# Altium schematic sheet MKRWANV1.0_1.SchDoc: MKRWANV1.0
size 409 x 289 mm; Origin: Eagle; Date: 4/10/2019 9:46:02 AM; SheetNumber: 2; CODE-ARDUINO: DNP; DATASHEET: DNP; DISTRIBUTOR-LINK: DNP; DISTRIBUTOR-PN: DNP; MANUFACTURER: DNP; MANUFACTURER-PN: DNP; NOTE: DNP; Value: DNP; GateName_1: G$1; SymbolName_1: A3L-LOC; LibraryName: Arduino-utility; DeviceSetName: A3-FRAME; Sheet: Sheet:; ReferenceDesignsAREPROVIDED"ASIS"AND"WITHALLFAULTS.ArduinoSADISCLAIMSALLOTHERWARRANTIES,EXPRESSORIMPLIED,
REGARDINGPRODUCTS,INCLUDINGBUTNOTLIMITEDTO,ANYIMPLIEDWARRANTIESOFMERCHANTABILITYORFITNESSFORAPARTICULARPURPOSE

ArduinoSAmaymakechangestospecificationsandproductdescriptionsatanytime,withoutnotice.TheCustomermustnot
relyontheabsenceorcharacteristicsofanyfeaturesorinstructionsmarked"reserved"or"undefined."ArduinoSAreserves
theseforfuturedefinitionandshallhavenoresponsibilitywhatsoeverforconflictsorincompatibilitiesarisingfromfuturechangestothem.
TheproductinformationontheWebSiteorMaterialsissubjecttochangewithoutnotice.Donotfinalizeadesignwiththisinfo

ARDUINOandotherArduinobrandsandlogosandTrademarksofArduinoSA.AllArduinoSATrademarkscannotbeusedwithoutowner'sformalpermission: Reference Designs ARE PROVIDED "AS IS" AND "WITH ALL FAULTS. Arduino SA DISCLAIMS ALL OTHER WARRANTIES, EXPRESS OR IMPLIED, / REGARDING PRODUCTS, INCLUDING BUT NOT LIMITED TO, ANY IMPLIED WARRANTIES OF MERCHANTABILITY OR FITNESS FOR A PARTICULAR PURPOSE / Arduino SA may make changes to specifications and product descriptions at any time, without notice. The Customer must not / rely on the absence or characteristics of any features or instructions marked "reserved" or "undefined." Arduino SA reserves / these for future definition and shall have no responsibility whatsoever for conflicts or incompatibilities arising from future changes to them. / The product information on the Web Site or Materials is subject to change without notice. Do not finalize a design with this info / ARDUINO and other Arduino brands and logos and Trademarks of Arduino SA. All Arduino SA Trademarks cannot be used without owner's formal permission
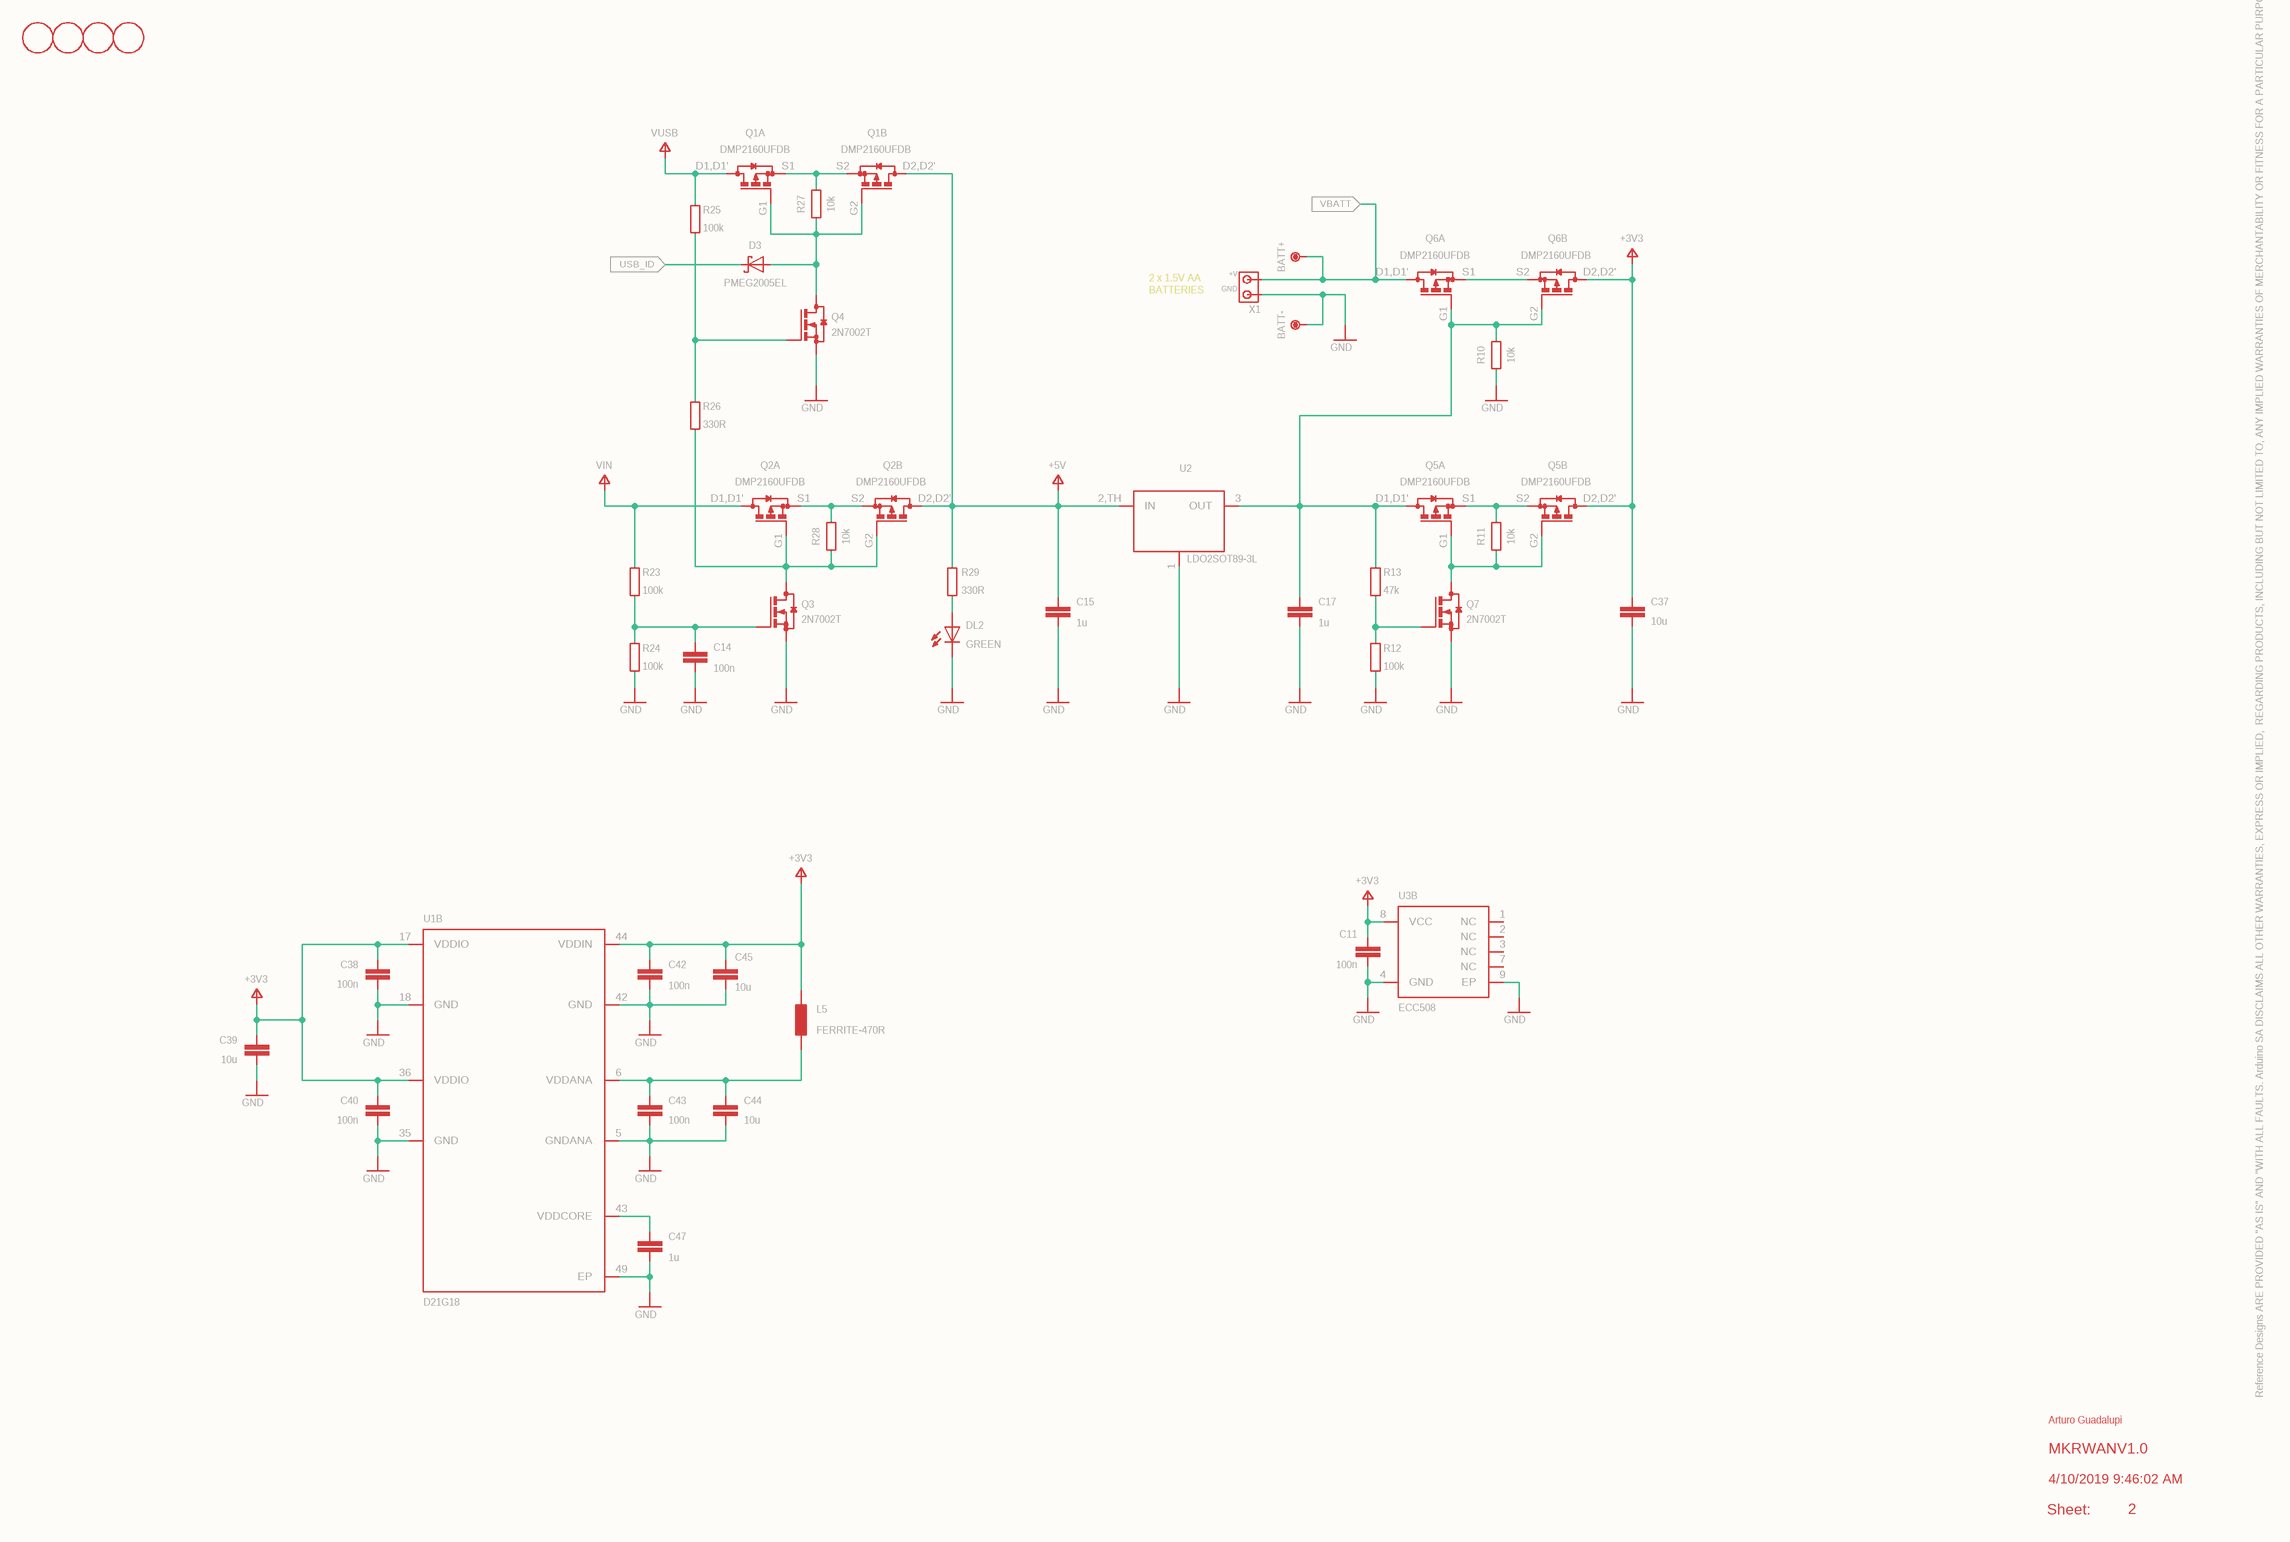
[diagram p0: MKRWANV1.0_1.SchDoc]

## Parts
+3V1  +3V3
+3V38  +3V3
+3V310  +3V3
+3V313  +3V3
BATT+  DNP  [TP-1.00MM]  (value not drawn)
BATT-  DNP  [TP-1.00MM]  (value not drawn)
C11  100n  [0402-1005X55N]
C14  100n  [0402-1005X55N]
C15  1u  [0402-1005X55N]
C17  1u  [0402-1005X55N]
C37  10u  [0603-1608X90N]
C38  100n  [0402-1005X55N]
C39  10u  [0603-1608X90N]
C40  100n  [0402-1005X55N]
C42  100n  [0402-1005X55N]
C43  100n  [0402-1005X55N]
C44  10u  [0603-1608X90N]
C45  10u  [0603-1608X90N]
C47  1u  [0402-1005X55N]
D3  PMEG2005EL  [SODFL1008X40N-882D]
DL2  GREEN  [LEDC1608X80N-AK]
FD1  DNP  [FD-1-1.5]  (value not drawn)
FD2  DNP  [FD-1-1.5]  (value not drawn)
FD3  DNP  [FD-1-1.5]  (value not drawn)
FD4  DNP  [FD-1-1.5]  (value not drawn)
GND14  GND
GND16  GND
GND18  GND
GND20  GND
GND25  GND
GND26  GND
GND27  GND
GND28  GND
GND29  GND
GND30  GND
GND31  GND
GND32  GND
GND40  GND
GND45  GND
GND46  GND
GND47  GND
GND48  GND
GND49  GND
GND51  GND
GND52  GND
GND53  GND
L5  FERRITE-470R  [0603-1608X90N@1]
P+3  +5V
Q1  DMP2160UFDB  [PWR_SC70]  (parts A,B of 2)
Q2  DMP2160UFDB  [PWR_SC70]  (parts A,B of 2)
Q3  2N7002T  [SOTFL50P160X78-3]
Q4  2N7002T  [SOTFL50P160X78-3]
Q5  DMP2160UFDB  [PWR_SC70]  (parts A,B of 2)
Q6  DMP2160UFDB  [PWR_SC70]  (parts A,B of 2)
Q7  2N7002T  [SOTFL50P160X78-3]
R10  10k  [0402-1005X55N]
R11  10k  [0402-1005X55N]
R12  100k  [0402-1005X55N]
R13  47k  [0402-1005X55N]
R23  100k  [0402-1005X55N]
R24  100k  [0402-1005X55N]
R25  100k  [0402-1005X55N]
R26  330R  [0402-1005X55N]
R27  10k  [0402-1005X55N]
R28  10k  [0402-1005X55N]
R29  330R  [0402-1005X55N]
U1  D21G18  [QFN50P700X700X90-49XN-EPSQ515]  (part B of 2)
U2  LDO2SOT89-3L  [SOT89-3L]
U3  ECC508  [SON50P300X200X60-9N-EP160X140]  (part B of 2)
V2  VUSB
VIN2  VIN
X1  SCREW2X2.54  [SCREW2]  (value not drawn)

## Ports
USB_ID (in), VBATT (in)

## Nets
USB_ID: D3.C ; port USB_ID
VBATT: BATT+.X(P$1) Q6.D1,D1'(D) X1.V+ ; port VBATT
Net+3V1_?1: +3V1.?1(+3V3) C11.1 U3.8(VCC)
Net+3V38_?1: +3V38.?1(+3V3) C37.1 Q5.D2,D2'(D) Q6.D2,D2'(D)
Net+3V310_?1: +3V310.?1(+3V3) C38.1 C39.1 C40.1 U1.17(VDDIO) U1.36(VDDIO)
Net+3V313_?1: +3V313.?1(+3V3) C42.1 C45.1 L5.1 U1.44(VDDIN)
NetBATT-_X: BATT-.X(P$1) GND32.?1(GND) X1.GND
NetC11_2: C11.2 GND25.?1(GND) U3.4(GND)
NetC14_1: C14.1 Q3.G R23.1 R24.2
NetC14_2: C14.2 GND29.?1(GND)
NetC15_1: C15.1 P+3.?1(+5V) Q1.D2,D2'(D) Q2.D2,D2'(D) R29.2 U2.2,TH(IN)
NetC15_2: C15.2 GND31.?1(GND)
NetC17_1: C17.1 Q5.D1,D1'(D) Q6.G1(G) Q6.G2(G) R10.2 R13.2 U2.3(OUT)
NetC17_2: C17.2 GND45.?1(GND)
NetC37_2: C37.2 GND46.?1(GND)
NetC38_2: C38.2 GND47.?1(GND) U1.18(GND)
NetC39_2: C39.2 GND48.?1(GND)
NetC40_2: C40.2 GND49.?1(GND) U1.35(GND)
NetC42_2: C42.2 C45.2 GND51.?1(GND) U1.42(GND)
NetC43_1: C43.1 C44.1 L5.2 U1.6(VDDANA)
NetC43_2: C43.2 C44.2 GND52.?1(GND) U1.5(GNDANA)
NetC47_1: C47.1 U1.43(VDDCORE)
NetC47_2: C47.2 GND53.?1(GND) U1.49(EP)
NetD3_A: D3.A Q1.G1(G) Q1.G2(G) Q4.D R27.1
NetDL2_A: DL2.A R29.1
NetDL2_C: DL2.C GND30.?1(GND)
NetGND14_?1: GND14.?1(GND) R10.1
NetGND16_?1: GND16.?1(GND) R12.1
NetGND18_?1: GND18.?1(GND) Q7.S
NetGND20_?1: GND20.?1(GND) U2.1(GND/ADJ)
NetGND26_?1: GND26.?1(GND) R24.1
NetGND27_?1: GND27.?1(GND) Q3.S
NetGND28_?1: GND28.?1(GND) Q4.S
NetGND40_?1: GND40.?1(GND) U3.9(EP)
NetQ1_D1,D1': Q1.D1,D1'(D) R25.2 V2.?1(VUSB)
NetQ1_S1: Q1.S1(S) Q1.S2(S) R27.2
NetQ2_D1,D1': Q2.D1,D1'(D) R23.2 VIN2.?1(VIN)
NetQ2_G1: Q2.G1(G) Q2.G2(G) Q3.D R26.1 R28.1
NetQ2_S1: Q2.S1(S) Q2.S2(S) R28.2
NetQ4_G: Q4.G R25.1 R26.2
NetQ5_G1: Q5.G1(G) Q5.G2(G) Q7.D R11.1
NetQ5_S1: Q5.S1(S) Q5.S2(S) R11.2
NetQ6_S1: Q6.S1(S) Q6.S2(S)
NetQ7_G: Q7.G R12.2 R13.1

Not connected (* = marked no-connect by the designer): U3 1(NC) 2(NC) 3(NC) 7(NC)

## Notes on the sheet
- (near X1) 2 x 1.5V AA
  BATTERIES
- Reference Designs ARE PROVIDED "AS IS" AND "WITH ALL FAULTS. Arduino SA DISCLAIMS ALL OTHER WARRANTIES, EXPRESS OR IMPLIED,
  REGARDING PRODUCTS, INCLUDING BUT NOT LIMITED TO, ANY IMPLIED WARRANTIES OF MERCHANTABILITY OR FITNESS FOR A PARTICULAR PURPOSE
  Arduino SA may make changes to specifications and product descriptions at any time, without notice. The Customer must not
  rely on the absence or characteristics of any features or instructions marked "reserved" or "undefined." Arduino SA reserves
  these for future definition and shall have no responsibility whatsoever for conflicts or incompatibilities arising from future changes to them.
  The product information on the Web Site or Materials is subject to change without notice. Do not finalize a design with this info
  ARDUINO and other Arduino brands and logos and Trademarks of Arduino SA. All Arduino SA Trademarks cannot be used without owner's formal permission
- Arturo Guadalupi
- MKRWANV1.0
- Sheet:
- 4/10/2019 9:46:02 AM
- 2

## Library data of the parts
+3V1 +3V38 +3V310 +3V313 = +3V3: SUPPLY SYMBOL; GateName_1: G$1; SymbolName_1: +3V3; LibraryName: MK1_Zero; DeviceSetName: +3V3
BATT+ BATT- = TPTP-1.00MM: Testpoint; GateName_1: G$1; DeviceSetName: TP; SymbolName_1: TESTPOINT; DeviceName: TP-1.00MM; LibraryName: Arduino-utility; DATASHEET: DNP; DISTRIBUTOR-LINK: DNP; DISTRIBUTOR-PN: DNP; MANUFACTURER: DNP; MANUFACTURER-PN: DNP
C11 C14 C38 C40 C42 C43 = C-0402: SMD Capacitor; MANUFACTURER: TDK; MANUFACTURER-PN: C1005X5R1H104K050BB; GateName_1: G$1; SymbolName_1: C; DeviceName: -0402; LibraryName: Arduino-rcl; DeviceSetName: C; DATASHEET: http://www.tdk.com/pdf/TDKMLCCCapRange.pdf; DISTRIBUTOR-LINK: http://www.digikey.com/product-detail/en/tdk-corporation/C1005X5R1H104K050BB/445-5942-1-ND/2443982; DISTRIBUTOR-PN: 445-5942-1-ND
C15 C17 C47 = C-0402: SMD Capacitor; MANUFACTURER: Murata; MANUFACTURER-PN: GRM155R61E105KA12D; GateName_1: G$1; SymbolName_1: C; DeviceName: -0402; LibraryName: Arduino-rcl; DeviceSetName: C; DATASHEET: http://search.murata.co.jp/Ceramy/image/img/A01X/partnumbering_e_01.pdf; DISTRIBUTOR-LINK: http://www.digikey.com/product-detail/en/murata-electronics-north-america/GRM155R61E105KA12D/490-10017-1-ND/5026367; DISTRIBUTOR-PN: 490-10017-1-ND
C37 C39 C44 C45 = C-0603: SMD Capacitor; MANUFACTURER: Murata; MANUFACTURER-PN: GRM188R61C106KAALD; GateName_1: G$1; SymbolName_1: C; DeviceName: -0603; LibraryName: Arduino-rcl; DeviceSetName: C; DATASHEET: http://www.murata.com/~/media/webrenewal/support/library/catalog/products/capacitor/mlcc/c02e.pdf; DISTRIBUTOR-LINK: http://www.digikey.com/product-search/en?keywords=490-10728-1-ND; DISTRIBUTOR-PN: 490-10728-1-ND
D3 = PMEG2005EL: DIODE SCHOTTKY 20V 500MA SOD882; MANUFACTURER: NXP; MANUFACTURER-PN: PMEG2005EL,315; GateName_1: G$1; SymbolName_1: SCHOTTKY-1; LibraryName: Arduino-diodes; DeviceSetName: PMEG2005EL; DATASHEET: http://www.nxp.com/documents/data_sheet/PMEG2005EL.pdf; DISTRIBUTOR-LINK: http://www.digikey.com/product-detail/en/nxp-semiconductors/PMEG2005EL,315/568-6754-1-ND/2676794; DISTRIBUTOR-PN: 568-6754-1-ND
DL2 = LED-0603: LED; MANUFACTURER: Avago; MANUFACTURER-PN: HSMG-C190; GateName_1: G$1; DeviceName: -0603; SymbolName_1: LED; LibraryName: Arduino-diodes; DeviceSetName: LED; DATASHEET: http://media.digikey.com/pdf/Data%20Sheets/Avago%20PDFs/HSMz-Czzz.pdf; DISTRIBUTOR-LINK: http://www.digikey.com/product-detail/en/broadcom-limited/HSMG-C190/516-1425-1-ND/637749; DISTRIBUTOR-PN: 516-1425-1-ND
FD1-FD4 = FIDUCIAL-1.5MM: Fiducial mount; GateName_1: G$1; SymbolName_1: ARDUINO_FIDUCIAL; DeviceName: -1.5MM; LibraryName: Arduino-utility; DeviceSetName: FIDUCIAL; DATASHEET: DNP; DISTRIBUTOR-LINK: DNP; DISTRIBUTOR-PN: DNP; MANUFACTURER: DNP; MANUFACTURER-PN: DNP
GND14 GND16 GND18 GND20 GND25-GND32 GND40 GND45-GND49 GND51-GND53 = GND: SUPPLY SYMBOL; GateName_1: 1; SymbolName_1: GND; DeviceSetName: GND
  GND14 GND16 GND18 GND20 GND25-GND32 GND40 GND45 GND46: LibraryName: supply1
  GND47-GND49 GND51-GND53: LibraryName: MK1_Zero
L5 = FERRITE: FERRITE BEAD 470 OHM 0603 1LN; MANUFACTURER: Murata; MANUFACTURER-PN: BLM18PG471SN1D; GateName_1: >NAME; SymbolName_1: FERRITE; LibraryName: Arduino-rcl; DeviceSetName: FERRITE; DATASHEET: http://search.murata.co.jp/Ceramy/image/img/PDF/ENG/L0110S0100BLM18P.pdf; DISTRIBUTOR-LINK: http://www.digikey.com/product-detail/en/murata-electronics-north-america/BLM18PG471SN1D/490-5223-1-ND/1948399; DISTRIBUTOR-PN: 490-5223-1-ND
P+3 = +5V: SUPPLY SYMBOL; GateName_1: 1; SymbolName_1: +5V; LibraryName: MK1_Zero; DeviceSetName: +5V
Q1 Q2 Q5 Q6 = DMP2160UFDB: MOSFET 2P-CH 20V 3.8A 6UDFN; MANUFACTURER: DNP; GateName_1: A; SymbolName_1: P-MOS-1; GateName_2: B; SymbolName_2: P-MOS-1; LibraryName: Arduino-transistors; DeviceSetName: DMP2160UFDB; DATASHEET: DNP; DISTRIBUTOR-LINK: DNP; DISTRIBUTOR-PN: DNP; MANUFACTURER-PN: DNP
Q3 Q4 Q7 = 2N7002T: MOSFET N-CH 60V 115MA SOT-523; MANUFACTURER: Diodes Incorporated; MANUFACTURER-PN: 2N7002T-7-F; GateName_1: G$1; SymbolName_1: N-MOS-1; LibraryName: Arduino-transistors; DeviceSetName: 2N7002T; DATASHEET: http://www.diodes.com/_files/datasheets/ds30301.pdf; DISTRIBUTOR-LINK: http://www.digikey.com/product-detail/en/diodes-incorporated/2N7002T-7-F/2N7002T-FDICT-ND/815290; DISTRIBUTOR-PN: 2N7002T-FDICT-ND
R10 R11 R27 R28 = R-0402: SMD Resistor; MANUFACTURER: Yageo; MANUFACTURER-PN: RC0402FR-0710KL; GateName_1: G$1; SymbolName_1: R; DeviceName: -0402; LibraryName: Arduino-rcl; DeviceSetName: R; DATASHEET: www.yageo.com.tw/exep/pages/download/literatures/PYu-R_INT-thick_7.pdf; DISTRIBUTOR-LINK: http://www.digikey.com/product-detail/en/yageo/RC0402FR-0710KL/311-10.0KLRCT-ND/729470; DISTRIBUTOR-PN: 311-10.0KLRCT-ND
R12 R23-R25 = R-0402: SMD Resistor; MANUFACTURER: Yageo; MANUFACTURER-PN: RC0402FR-07100KL; GateName_1: G$1; SymbolName_1: R; DeviceName: -0402; LibraryName: Arduino-rcl; DeviceSetName: R; DATASHEET: www.yageo.com.tw/exep/pages/download/literatures/PYu-R_INT-thick_7.pdf; DISTRIBUTOR-LINK: http://www.digikey.com/product-detail/en/yageo/RC0402FR-07100KL/311-100KLRCT-ND/729473; DISTRIBUTOR-PN: 311-100KLRCT-ND
R13 = R-0402: SMD Resistor; MANUFACTURER: Yageo; MANUFACTURER-PN: RC0402JR-0747KL; GateName_1: G$1; SymbolName_1: R; DeviceName: -0402; LibraryName: Arduino-rcl; DeviceSetName: R; DATASHEET: www.yageo.com.tw/exep/pages/download/literatures/PYu-R_INT-thick_7.pdf; DISTRIBUTOR-LINK: http://www.digikey.com/product-detail/en/yageo/RC0402JR-0747KL/311-47KJRCT-ND/729432; DISTRIBUTOR-PN: 311-47KJRCT-ND
R26 R29 = R-0402: SMD Resistor; MANUFACTURER: Yageo; MANUFACTURER-PN: RC0402FR-07330RL; GateName_1: G$1; SymbolName_1: R; DeviceName: -0402; LibraryName: Arduino-rcl; DeviceSetName: R; DATASHEET: www.yageo.com.tw/exep/pages/download/literatures/PYu-R_INT-thick_7.pdf; DISTRIBUTOR-LINK: http://www.digikey.com/product-detail/en/yageo/RC0402FR-07330RL/311-330LRCT-ND/729541; DISTRIBUTOR-PN: 311-330LRCT-ND
U1 = ATSAMD21G18A-48QFN: ARMÂ® CortexÂ®-M0+ SAM D21G Microcontroller IC 32-Bit 48MHz 256KB (256K x 8) FLASH 48-TQFP (7x7); MANUFACTURER: DNP; GateName_1: A; SymbolName_1: ATSAMD21G18A-48-A; GateName_2: B; SymbolName_2: ATSAMD21G18A-48-B; DeviceName: QFN; LibraryName: Arduino-ucs&SoCs; DeviceSetName: ATSAMD21G18A-48; DATASHEET: DNP; DISTRIBUTOR-LINK: DNP; DISTRIBUTOR-PN: DNP; MANUFACTURER-PN: DNP
U2 = LDO2: MANUFACTURER: Diodes Inc; MANUFACTURER-PN: AP7215-33YG-13; GateName_1: G$1; SymbolName_1: LINEAR_3PINS; LibraryName: Arduino-ICs; DeviceSetName: LDO2; DATASHEET: http://www.diodes.com/_files/datasheets/AP7215.pdf; DISTRIBUTOR-LINK: http://www.digikey.com/product-detail/en/diodes-incorporated/AP7215-33YG-13/AP7215-33YG-13DICT-ND/2179740; DISTRIBUTOR-PN: AP7215-33YG-13DICT-ND
U3 = ATECC508A-MAHDA-T8-UDFN: Secure authentication and product validation device, EEPROM, I2C, 2.0 - 5.5V; MANUFACTURER: Atmel; GateName_1: A; SymbolName_1: ATECC508A-A; GateName_2: B; SymbolName_2: ATECC508A-B; DeviceName: 8-UDFN; LibraryName: Arduino-ICs; DeviceSetName: ATECC508A-MAHDA-T; DATASHEET: http://www.atmel.com/Images/Atmel-8923S-CryptoAuth-ATECC508A-Datasheet-Summary.pdf; DISTRIBUTOR-LINK: http://www.digikey.com/product-detail/en/atmel/ATECC508A-MAHDA-T/ATECC508A-MAHDA-TCT-ND/5213071; DISTRIBUTOR-PN: ATECC508A-MAHDA-TCT-ND; MANUFACTURER-PN: ATECC508A-MAHDA-T
V2 = VUSB: VUSB symbol; MANUFACTURER: DNP; GateName_1: G$1; SymbolName_1: VUSB; LibraryName: Arduino-supply; DeviceSetName: VUSB; DATASHEET: DNP; DISTRIBUTOR-LINK: DNP; DISTRIBUTOR-PN: DNP; MANUFACTURER-PN: DNP
VIN2 = VIN: VIN symbol; MANUFACTURER: DNP; GateName_1: G$1; SymbolName_1: VIN; LibraryName: Arduino-supply; DeviceSetName: VIN; DATASHEET: DNP; DISTRIBUTOR-LINK: DNP; DISTRIBUTOR-PN: DNP; MANUFACTURER-PN: DNP
X1 = SCREW2X2.54: 2.45 Screw terminal Block; MANUFACTURER: On Shore Technology Inc.; MANUFACTURER-PN: OSTVN02A150; GateName_1: G$1; SymbolName_1: SCREW2; LibraryName: Arduino-connectors; DeviceSetName: SCREW2X2.54; GND: GND; +V: +V; DATASHEET: http://www.on-shore.com/wp-content/uploads/2015/09/ostvnxxa150.pdf; DISTRIBUTOR-LINK: http://www.digikey.com/product-detail/en/on-shore-technology-inc/OSTVN02A150/ED10561-ND/1588862; DISTRIBUTOR-PN: ED10561-ND